# EAGLE design th2 (EAGLE 9.1.3)
CNAME: TempHumid; CREVISION: v2.0; DESIGNER: John Cronin
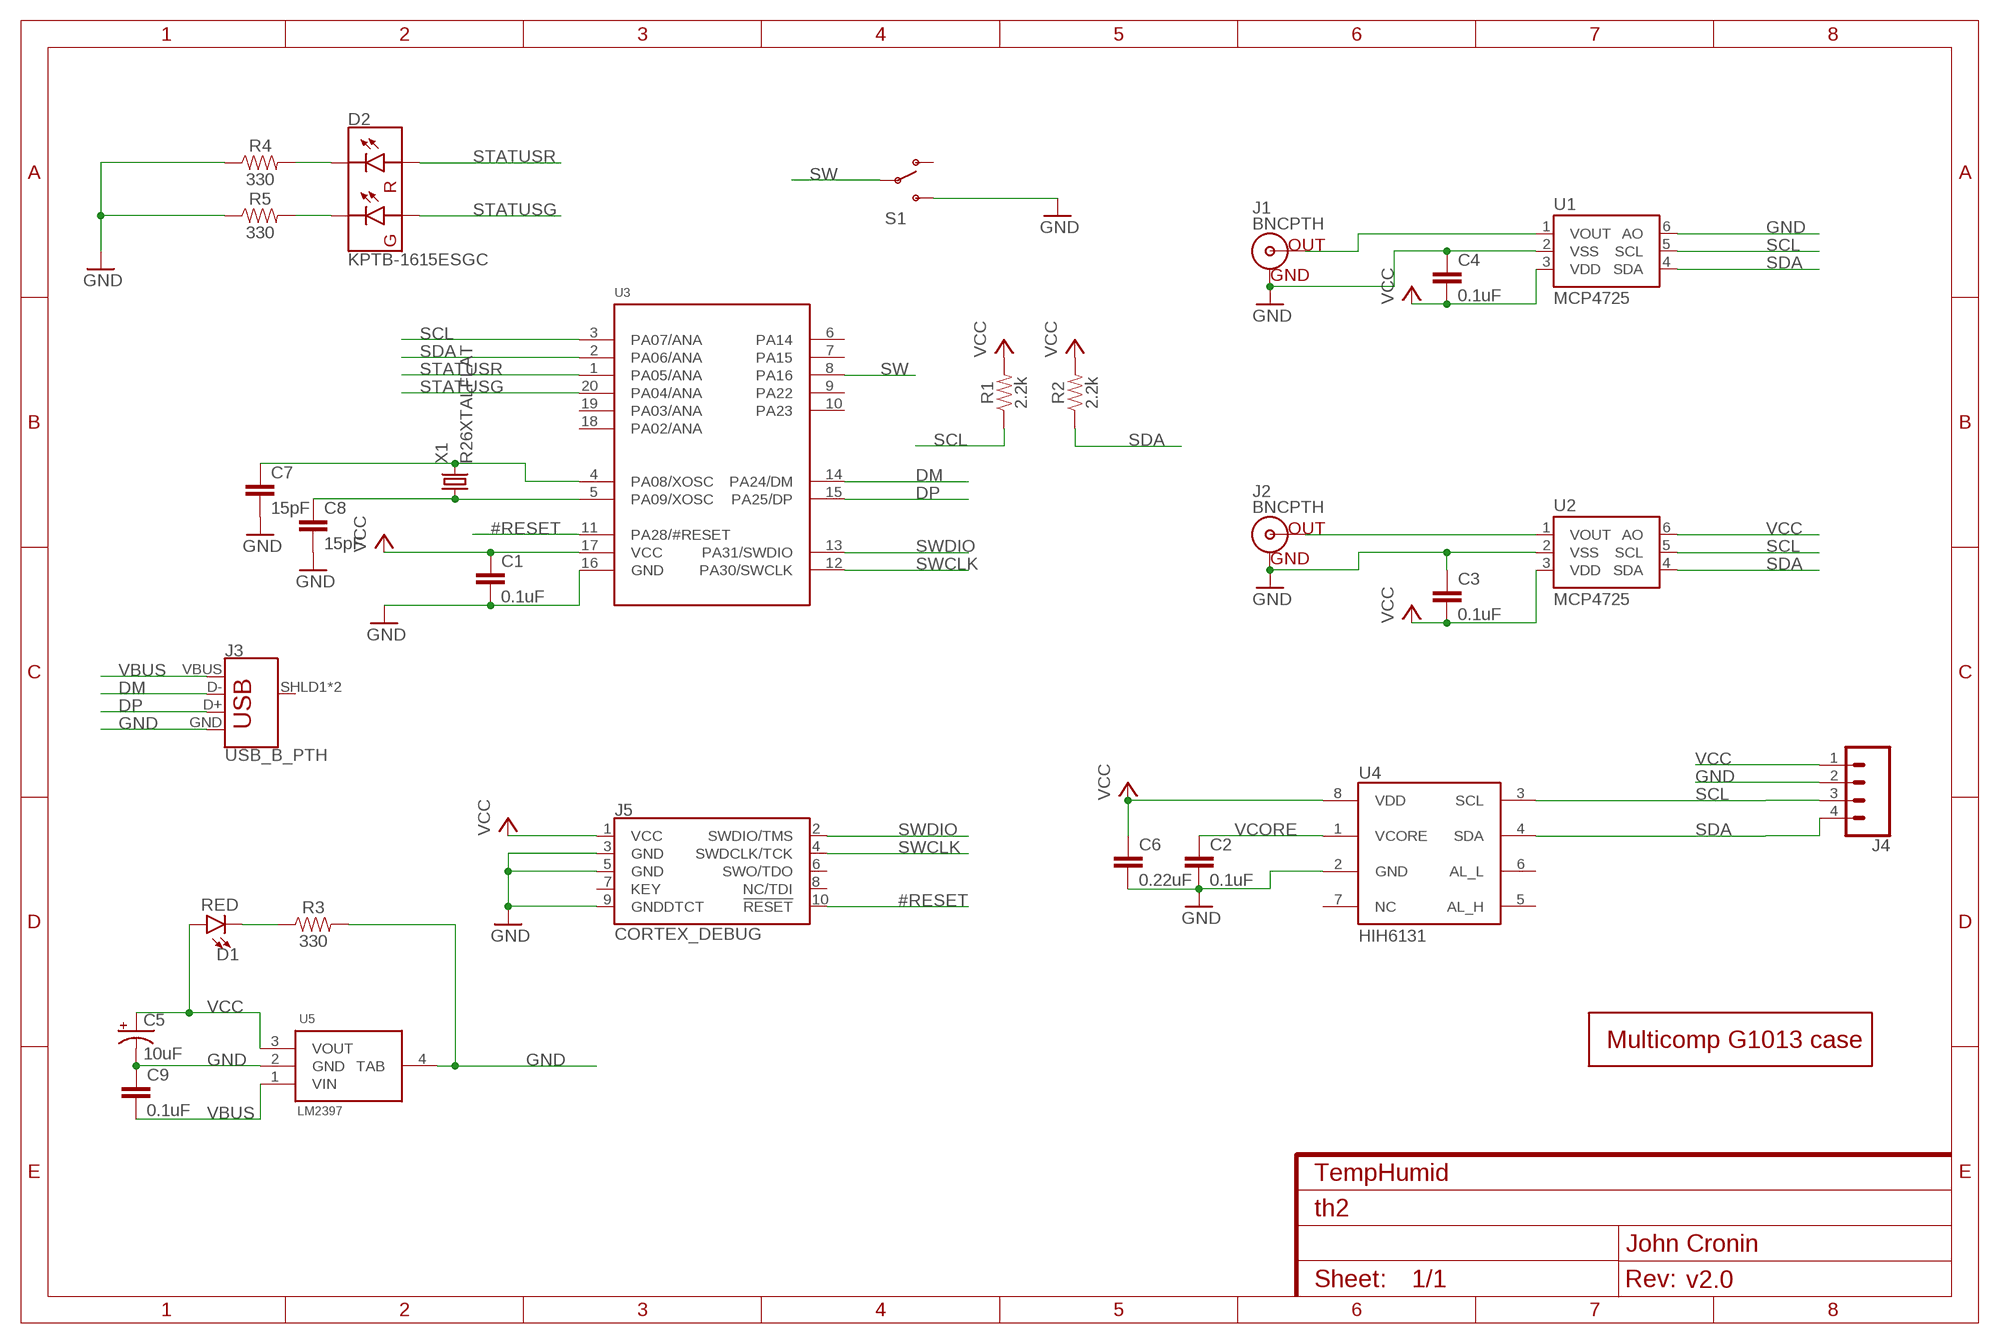
[diagram p0: schematic, sheet 1]

## Parts
C1  0.1uF  0.1UF-0603-25V-(+80/-20%)  [0603]
C2  0.1uF  0.1UF-0603-25V-(+80/-20%)  [0603]
C3  0.1uF  0.1UF-0603-25V-(+80/-20%)  [0603]
C4  0.1uF  0.1UF-0603-25V-(+80/-20%)  [0603]
C5  10uF  10UF-POLAR-RADIAL-2.5MM-25V-20%  [CPOL-RADIAL-2.5MM-5MM]
C6  0.22uF  0.22UF-0603-25V-10%  [0603]
C7  15pF  15PF-0603-50V-5%  [0603]
C8  15pF  15PF-0603-50V-5%  [0603]
C9  0.1uF  0.1UF-0603-25V-(+80/-20%)  [0603]
D1  RED  LED-RED0603  [LED-0603]
D2  KPTB-1615ESGC  LED-RGLTST-C195KGJRKT  [LTST-C195KGJRKT]
J1  BNCPTH  [BNC]
J2  BNCPTH  [BNC]
J3  USB_B_PTH  [USB-B-PTH]
J4  CONN_041.27MM  [1X04_1.27MM]
J5  CORTEX_DEBUG  [SAMTECH_FTSH-105-01]
R1  2.2k  2.2KOHM-0603-1/10W-1%  [0603]
R2  2.2k  2.2KOHM-0603-1/10W-1%  [0603]
R3  330  330OHM-0603-1/10W-1%  [0603]
R4  330  330OHM-0603-1/10W-1%  [0603]
R5  330  330OHM-0603-1/10W-1%  [0603]
S1  SWITCH-SPDTSMD  [SWITCH_SPDT_SMD]
U1  MCP4725  MCP4725SOT-23  [SOT23-6]
U2  MCP4725  MCP4725SOT-23  [SOT23-6]
U3  SAMD11D14A  [SOIC20L]
U4  HIH6131  [SOIC8]
U5  LM2397  [SOT223]
U$1  G1013HOLES  [G1013HOLES]
X1  R26XTALFLAT  [R26FLAT]

## Nets
#RESET: J5.10(!RESET) U3.11(PA28/#RESET)
DM: J3.D- U3.14(PA24/DM)
DP: J3.D+ U3.15(PA25/DP)
GND [power]: C1.2 C2.2 C3.1 C4.1 C5.2(-) C6.2 C7.2 C8.2 C9.1 J1.GND J2.GND J3.GND J4.2 J5.3(GND) J5.5(GND) J5.9(GNDDTCT) R3.2 R4.1 R5.1 S1.3(S) U1.2(VSS) U1.6(AO) U2.2(VSS) U3.16(GND) U4.2(GND) U5.2(GND) U5.4(TAB)
N$1: C7.1 U3.4(PA08/XOSC) X1.P$2
N$2: C8.1 U3.5(PA09/XOSC) X1.P$1
N$3: D1.C R3.1
N$4: D2.P$4(RC) R4.2
N$5: D2.P$3(GC) R5.2
N$6: J1.S(OUT) U1.1(VOUT)
N$9: J2.S(OUT) U2.1(VOUT)
SCL: J4.3 R1.1 U1.5(SCL) U2.5(SCL) U3.3(PA07/ANA) U4.3(SCL)
SDA: J4.4 R2.1 U1.4(SDA) U2.4(SDA) U3.2(PA06/ANA) U4.4(SDA)
STATUSG: D2.P$1(GA) U3.20(PA04/ANA)
STATUSR: D2.P$2(RA) U3.1(PA05/ANA)
SW: S1.2(P) U3.8(PA16)
SWCLK: J5.4(SWDCLK/TCK) U3.12(PA30/SWCLK)
SWDIO: J5.2(SWDIO/TMS) U3.13(PA31/SWDIO)
VBUS [power]: C9.2 J3.VBUS U5.1(VIN)
VCC [power]: C1.1 C3.2 C4.2 C5.1(+) C6.1 D1.A J4.1 J5.1(VCC) R1.2 R2.2 U1.3(VDD) U2.3(VDD) U2.6(AO) U3.17(VCC) U4.8(VDD) U5.3(VOUT)
VCORE: C2.1 U4.1(VCORE)
Unconnected: J3.SHLD1(SHIELD) J3.SHLD2(SHIELD) J5.6(SWO/TDO) J5.7(KEY) J5.8(NC/TDI) S1.1(O) U3.6(PA14) U3.7(PA15) U3.9(PA22) U3.10(PA23) U3.18(PA02/ANA) U3.19(PA03/ANA) U4.5(AL_H) U4.6(AL_L) U4.7(NC)

## Library data of the parts
C1-C4 C9 = SparkFun-Capacitors:0.1UF: 0.1µF ceramic capacitors A capacitor is a passive two-terminal electrical component used to store electrical energy temporarily in an electric field.; PROD_ID: CAP-00810
C5 = SparkFun-Capacitors:10UF-POLAR: 10.0µF polarized capacitors A capacitor is a passive two-terminal electrical component used to store electrical energy temporarily in an electric field.; PROD_ID: CAP-08440
C6 = SparkFun-Capacitors:0.22UF: 0.22µF ceramic capacitors A capacitor is a passive two-terminal electrical component used to store electrical energy temporarily in an electric field.; PROD_ID: CAP-07822
C7 C8 = SparkFun-Capacitors:15PF: 15pF ceramic capacitors A capacitor is a passive two-terminal electrical component used to store electrical energy temporarily in an electric field.; PROD_ID: CAP-07881
D1 = SparkFun-LED:LED-RED: Red SMD LED Used in manufacturing of most products at SparkFun Packages: 0603 - SMD 0603 package [Product Link] <http://docs.avagotech.com/docs/AV02-0551EN> 0603 SMART - SMD 0603 SMART package ( more efficient and expensive)[Product Link] <http://www.osram-os.com/Graphics/XPic2/00077099_0.pdf> 1206 - SMD1206 package [Product Link] <https://www.sparkfun.com/datasheets/DevTools/LilyPad/Q150OVS4.pdff> SparkFun Products: Pro Mini 328 -5V <https://www.sparkfun.com/products/821> RedBoard <https://www.sparkfun.com/products/12757> IOIO-OTG <https://www.sparkfun.com/products/13613>; PROD_ID: DIO-00819
D2 = SparkFun-LED:LED-RG: LiteOn Technology Corporation LTST-C195KGJRKT - LED GREEN/RED CLEAR 0606 SMD Color: Red/Green Lens Transparency: Clear Lens Style/Size: Rectangle with Flat top, 1.10 x 1.5 mm mC Rating45mcd Red, 35 mcd Green Current: 20mA Red, 20mA Green Forward Voltage: 2V Red, 2V Green Packages: 0606 SparkFun Products: Electric Imp imp002 Breakout <[https://www.sparkfun.com/products/12958]>; PROD_ID: DIO-12140
J1 J2 = SparkFun-Connectors:BNC: BNC Right Angle Connector Mouser Part# 5227161 SparkFun Products: BNC Connector - Right Angle <https://www.sparkfun.com/products/10550>; PROD_ID: LPA-12729; SF_ID: PRT-10550
J3 = SparkFun-Connectors:USB_B: USB Type B Connector SparkFun Products: SparkFun Stepoko <https://www.sparkfun.com/products/13899> PTH; PROD_ID: CONN-08278; SF_ID: PRT-00139
J4 = SparkFun-Connectors:CONN_04: Multi connection point. Often used as Generic Header-pin footprint for 0.1 inch spaced/style header connections On any of the 0.1 inch spaced packages, you can populate with these: Break Away Headers - Straight <https://www.sparkfun.com/products/116> (PRT-00116) Break Away Male Headers - Right Angle <https://www.sparkfun.com/products/553> (PRT-00553) Female Headers <https://www.sparkfun.com/products/115> (PRT-00115) Break Away Headers - Machine Pin <https://www.sparkfun.com/products/117> (PRT-00117) Break Away Female Headers - Swiss Machine Pin <https://www.sparkfun.com/products/743> (PRT-00743) For SCREWTERMINALS and SPRING TERMINALS visit here: Screw Terimnals on SparkFun.com <https://www.sparkfun.com/search/results?term=Screw+Terminals> (5mm/3.5mm/2.54mm spacing) This device is also useful as a general connection point to wire up your design to another part of your project. Our various solder wires solder well into these plated through hole pads. Hook-Up Wire - Assortment (Stranded, 22 AWG) <https://www.sparkfun.com/products/11375> (PRT-11375) Hook-Up Wire - Assortment (Solid Core, 22 AWG) <https://www.sparkfun.com/products/11367> (PRT-11367) View the entire wire category on our website here <https://www.sparkfun.com/categories/141> Special notes: Molex polarized connector foot print use with SKU : PRT-08231 with associated crimp pins and housings. 1MM SMD Version SKU: PRT-10208
J5 = atmel-samd:CORTEX_DEBUG
R1 R2 = SparkFun-Resistors:2.2KOHM: 2.2kΩ resistor A resistor is a passive two-terminal electrical component that implements electrical resistance as a circuit element. Resistors act to reduce current flow, and, at the same time, act to lower voltage levels within circuits. - Wikipedia; PROD_ID: RES-08272
R3-R5 = SparkFun-Resistors:330OHM: 330Ω resistor A resistor is a passive two-terminal electrical component that implements electrical resistance as a circuit element. Resistors act to reduce current flow, and, at the same time, act to lower voltage levels within circuits. - Wikipedia; PROD_ID: RES-00818
S1 = SparkFun-Retired:SWITCH-SPDT: SPDT Switch Simple slide switch, Spark Fun Electronics SKU : COM-00102 DPDT SMT slide switch, AYZ0202, SWCH-08179
U1 U2 = SparkFun-IC-Conversion:MCP4725: MCP4725 DAC Microchip 12-bit I2C DAC, SOT23-6 Datasheet <https://cdn.sparkfun.com/datasheets/BreakoutBoards/MCP4725_2009.pdf> SparkFun Products SparkFun I2C DAC Breakout - MCP4725 <https://www.sparkfun.com/products/12918> (BOB-12918); PROD_ID: IC-08886
U3 = atmel-samd:SAMD11D14A
U4 = SparkFun-Retired:HIH6131: Humidity sensor Not in catalog
U5 = atmel-samd:LM2397
U$1 = atmel-samd:G1013: Multicomp G1013 case
X1 = atmel-samd:R26XTAL: Raltron Radial Oscillator

## Net classes
1 power: width 0.305 mm

## Board
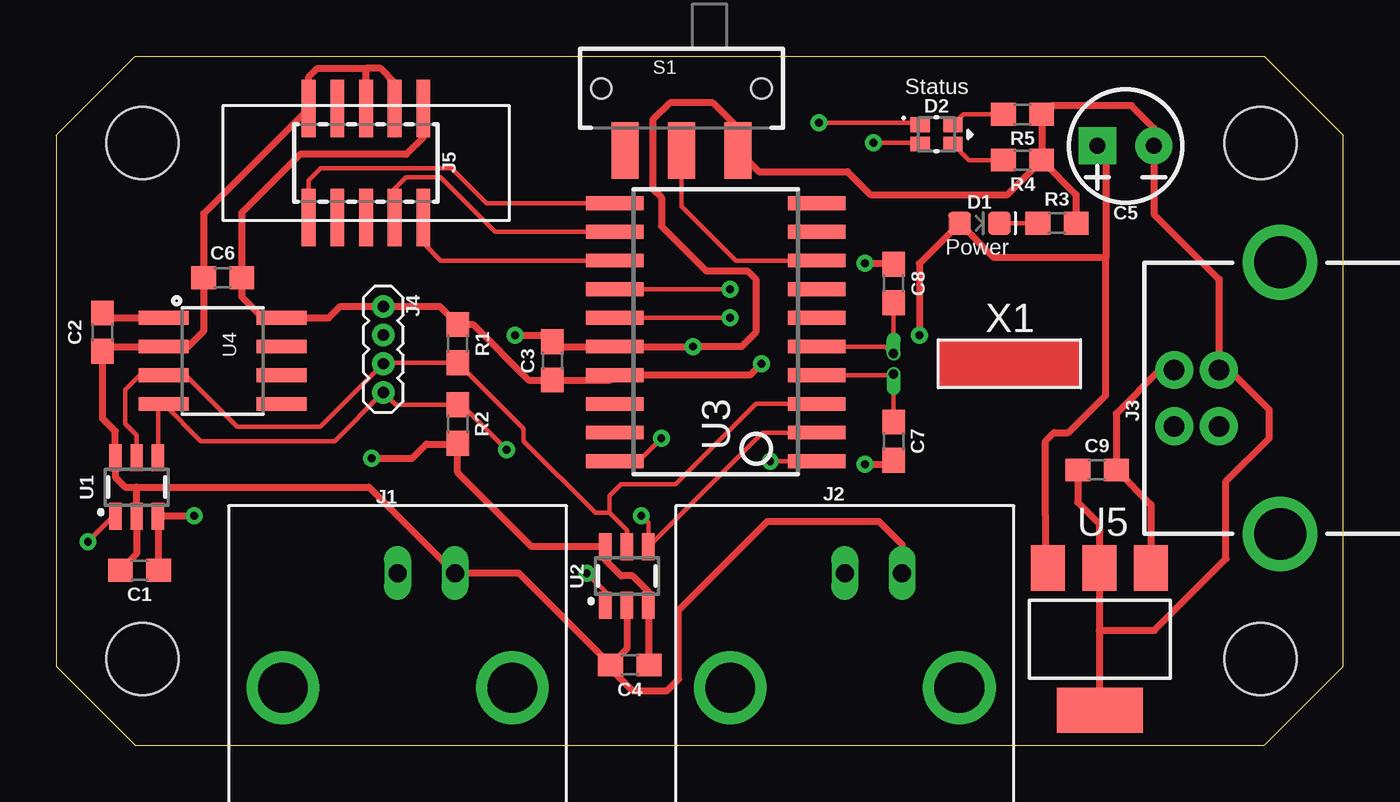
[diagram p1: board, top side]
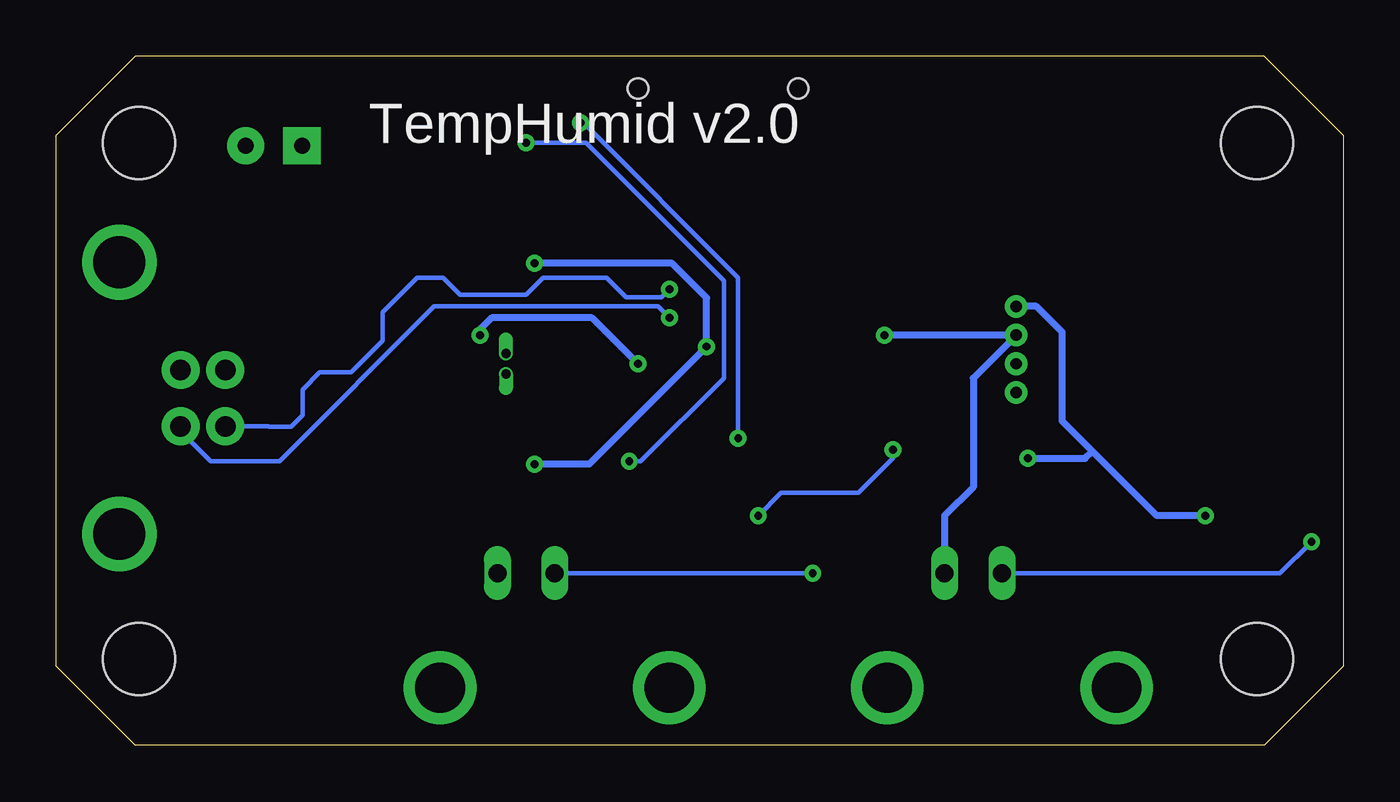
[diagram p2: board, bottom side, seen from below]

Size 57 x 30.5 mm. Coordinates in mm from the lower left corner, seen from the top.
Copper layers (1*16): Top 0.035mm / dielectric 1.5mm / Bottom 0.035mm
Design rules "jlcpcb-2oz": minimum track width 8mil, minimum drill 0.3mm, track to track 8mil, track to pad 8mil, pad to pad 8mil, via to via 8mil, smd to smd 5mil, copper to edge 0.2mm, drill to drill 6mil, minimum pad ring 3mil, minimum via ring 0.2mm, stop-mask expansion 4mil, vias tented up to drill 14mil, thermal gap 10mil

### Footprints (pad centres in the part's own frame; a part is rotated, then mirrored left to right if it is on the bottom)
0603 = smd 1.1 x 1: 1 -0.85,0; 2 0.85,0
CPOL-RADIAL-2.5MM-5MM = drill 0.7 pad 1.651 square: 1 1.25,0 | drill 0.7 pad 1.651: 2 -1.25,0
LED-0603 = smd 1 x 1: A -0.877,0; C 0.877,0
LTST-C195KGJRKT = smd 0.85 x 0.65: P$1 -0.725,0.425; P$2 -0.725,-0.425; P$3 0.725,0.425; P$4 0.725,-0.425
BNC = drill 2.2: 3 -5.08,5.08; 4 5.08,5.08 | drill 0.8 long: GND -2.54,0; S 0,0
USB-B-PTH = drill 0.914 pad 1.676: D+ 4,1.25; D- 5.981,1.25; GND 4,-1.25; VBUS 5.981,-1.25 | drill 2.286: SHLD1 1.282,-6.02; SHLD2 1.282,6.02
1X04_1.27MM = drill 0.508 pad 1: 1 0,0; 2 1.27,0; 3 2.54,0; 4 3.81,0
SAMTECH_FTSH-105-01 = smd 0.61 x 2.54: 1 -2.54,-2.413; 2 -2.54,2.413; 3 -1.27,-2.413; 4 -1.27,2.413; 5 0,-2.413; 6 0,2.413; 7 1.27,-2.413; 8 1.27,2.413; 9 2.54,-2.413; 10 2.54,2.413
SWITCH_SPDT_SMD = smd 1.2 x 2.5: 1 -2.5,-2.75; 2 0,-2.75; 3 2.5,-2.75 | hole 0.9: -3.55,0; 3.55,0
SOT23-6 = smd 0.55 x 1.2: 1 0.95,1.3; 2 0,1.3; 3 -0.95,1.3; 4 -0.95,-1.3; 5 0,-1.3; 6 0.95,-1.3
SOIC20L = smd 0.61 x 2.54: 1 -5.715,-4.475; 2 -4.445,-4.475; 3 -3.175,-4.475; 4 -1.905,-4.475; 5 -0.635,-4.475; 6 0.635,-4.475; 7 1.905,-4.475; 8 3.175,-4.475; 9 4.445,-4.475; 10 5.715,-4.475; 11 5.715,4.475; 12 4.445,4.475; 13 3.175,4.475; 14 1.905,4.475; 15 0.635,4.475; 16 -0.635,4.475; 17 -1.905,4.475; 18 -3.175,4.475; 19 -4.445,4.475; 20 -5.715,4.475
SOIC8 = smd 0.61 x 2.21: 1 -1.905,-2.616; 2 -0.635,-2.616; 3 0.635,-2.616; 4 1.905,-2.616; 5 1.905,2.616; 6 0.635,2.616; 7 -0.635,2.616; 8 -1.905,2.616
SOT223 = smd 1.499 x 2.007: 1 -2.261,-3.15; 2 0.025,-3.15; 3 2.311,-3.15 | smd 3.81 x 2.007: 4 0,3.15
G1013HOLES = hole 3.2: 3.81,26.67; 3.81,3.81; 53.34,3.81; 53.34,26.67
R26FLAT = drill 0.406 pad 0.597 offset: P$1 -0.457,0; P$2 0.457,0

### Placement (x,y rotation side)
C1  3.68,7.75 180 top
C2  2.03,18.29 270 top
C3  21.97,17.02 270 top
C4  25.4,3.56 0 top
C5  47.37,26.54 180 top
C6  7.37,20.7 180 top
C7  37.08,13.46 270 top
C8  37.08,20.45 90 top
C9  46.1,12.19 0 top
D1  40.89,23.11 0 top
D2  38.99,27.05 0 top
J1  15.11,7.62 180 top
J2  34.92,7.62 180 top
J3  55.5,15.37 180 top
J4  14.48,19.43 270 top
J5  13.72,25.78 180 top
R1  17.78,17.78 90 top
R2  17.78,14.22 270 top
R3  44.32,23.11 0 top
R4  42.8,25.91 180 top
R5  42.8,27.94 180 top
S1  27.69,29.08 0 top
U1  3.56,11.43 180 top
U2  25.27,7.49 180 top
U3  29.21,18.29 90 top
U4  7.37,17.02 270 top
U5  46.23,4.7 180 top
U$1  0,0 0 top
X1  37.08,16.89 270 top

### Tracks (layer width: path | path; a pad name or v marks a point on that pad's centre or on a via)
#RESET
  Top 0.203: U3.11 19.05,24 17.5,25.55 11.71,25.55 11.18,25.02 J5.10
DM  (via drill 0.35)
  Top 0.203: U3.14 v29.84,20.19
  Bottom 0.203: J3.D- 47.6,14.12 47.59,14.1 46.61,14.1 46.1,14.61 46.1,15.75 45.34,16.51 43.94,16.51 42.55,17.91 42.55,19.18 41.02,20.7 39.88,20.7 39.12,19.94 36.2,19.94 35.43,20.7 32.64,20.7 31.77,19.84 30.2,19.84 v29.84,20.19
DP  (via drill 0.35)
  Top 0.203: U3.15 v29.84,18.92
  Bottom 0.203: J3.D+ 51.5,13.91 50.16,12.57 47.12,12.57 40.26,19.43 30.35,19.43 v29.84,18.92
GND  (via drill 0.35)
  Top 0.305: U2.2 25.27,4.28 C4.1 | C1.2 3.56,8.47 U1.2 3.56,11.43 | 13.72,29.97 11.56,29.97 11.18,29.59 J5.9 6.52,23.53 C6.2 6.52,18.33 5.84,17.65 U4.2 2.25,17.65 C2.2 2.03,14.48 2.61,13.9 U1.6 2.61,11.87 3.05,11.43 3.56,11.43 | J5.3 14.99,29.34 14.35,29.97 13.72,29.97 | C4.1 24.55,3.39 25.53,2.41 27.05,2.41 27.56,2.92 27.56,5.97 31.5,9.91 36.45,9.91 37.47,8.89 J2.GND | C4.1 20.49,7.62 J1.GND 13.84,11.43 3.56,11.43 | R5.1 43.65,27.81 | 43.65,27.81 R4.1 | R4.1 45.17,24.38 R3.2 | R4.1 42.12,24.38 36.07,24.38 35.05,25.4 31.12,25.4 S1.3 30.19,27.34 29.08,28.45 27.18,28.45 26.42,27.69 26.42,24.64 26.8,24.26 26.8,22.99 28.78,21.01 30.61,21.01 30.99,20.62 30.99,18.29 30.35,17.65 v28.19,17.65 U3.16 22.19,17.65 C3.1 21.68,18.16 v20.32,18.16 | v35.81,21.34 37.05,21.34 C8.2 | v35.81,12.45 36.92,12.45 C7.2 | C9.1 45.25,10.76 46.2,9.8 U5.2 46.2,5.08 | 46.2,5.08 46.2,1.57 U5.4 | 46.2,5.08 48.64,5.08 51.82,8.26 51.82,11.68 53.72,13.59 53.72,14.86 51.96,16.62 J3.GND 51.5,20.64 48.62,23.52 C5.2 48.62,27.32 47.62,28.32 44.16,28.32 43.65,27.81 | J5.5 13.72,29.97
  Bottom 0.305: J1.GND 17.65,10.16 16.38,11.43 16.38,16.26 J4.2 v20.32,18.16 | v35.81,21.34 29.72,21.34 28.19,19.81 v28.19,17.65 33.4,12.45 v35.81,12.45
N$1
  Top 0.203: U3.4 36.93,16.38 X1.P$2 C7.1
N$2
  Top 0.203: U3.5 36.68,17.65 X1.P$1 C8.1
N$3
  Top 0.203: D1.C R3.1
N$4
  Top 0.203: D2.P$4 40.43,25.91 R4.2
N$5
  Top 0.203: D2.P$3 40.18,27.94 R5.2
N$6  (via drill 0.35)
  Top 0.203: v1.4,9.02 2.51,10.13 U1.1
  Bottom 0.203: J1.S 2.79,7.62 v1.4,9.02
N$9  (via drill 0.35)
  Top 0.203: v23.5,7.62 24.32,6.79 U2.1
  Bottom 0.203: J2.S v23.5,7.62
SCL
  Top 0.203: U1.5 3.56,13.72 3.05,14.22 3.05,15.75 3.68,16.38 U4.3 5.71,16.38 8,14.1 11.68,14.1 J4.3 14.52,16.93 R1.1 20.7,14.01 20.7,13.46 23.88,10.29 24.13,10.29 24.51,10.29 | U3.3 30.99,15.11 27.43,11.56 25.02,11.56 24.51,11.05 24.51,10.29 | U2.5 25.27,9.53 24.51,10.29
SDA  (via drill 0.35)
  Top 0.203: U1.4 4.51,14.87 U4.4 6.4,13.46 12.32,13.46 J4.4 15.03,15.07 R2.1 17.95,15.07 v19.94,13.08 | U3.2 31.27,13.84 U2.4 26.22,9.85 v25.91,10.16
  Bottom 0.203: v25.91,10.16 24.89,11.18 21.46,11.18 19.94,12.7 v19.94,13.08
STATUSG  (via drill 0.35)
  Top 0.203: U3.20 25.78,12.57 v26.8,13.59 | v33.78,27.56 38.18,27.56 D2.P$1
  Bottom 0.203: v26.8,13.59 26.8,20.7 33.66,27.56 v33.78,27.56
STATUSR  (via drill 0.35)
  Top 0.203: U3.1 v31.62,12.57 | v36.2,26.67 38.22,26.67 D2.P$2
  Bottom 0.203: v31.62,12.57 31.11,12.57 27.43,16.26 27.43,20.57 33.53,26.67 v36.2,26.67
SW
  Top 0.203: U3.8 30.1,21.46 27.69,23.88 S1.2
SWCLK
  Top 0.203: U3.12 19.43,22.73 17.02,25.15 15.49,25.15 14.99,24.64 J5.4
SWDIO
  Top 0.203: U3.13 17.02,21.46 16.26,22.23 J5.2
VBUS
  Top 0.305: U5.1 48.49,10.65 C9.2 46.95,14.69 48.88,16.62 J3.VBUS
VCC  (via drill 0.35)
  Top 0.305: C4.2 26.22,3.58 U2.3 26.22,6.8 25.53,7.49 25.02,7.49 24.32,8.19 U2.6 21.05,8.79 17.78,12.06 R2.2 17.74,13.34 16.38,13.34 15.75,12.7 v13.97,12.7 | C1.1 4.51,7.77 U1.3 4.54,10.16 v6.1,10.16 | J5.1 16.26,26.92 15.49,26.16 10.79,26.16 8.22,23.58 C6.1 8.22,19.85 9.14,18.92 U4.8 12.06,18.92 12.57,19.43 J4.1 16.98,19.43 R1.2 18.45,18.63 20.92,16.17 C3.2 24.52,16.17 U3.17 30.73,16.38 v31.24,16.89 | 46.48,21.59 45.72,21.59 | 45.72,21.59 41.54,21.59 D1.A 38.23,21.32 v38.23,18.16 | 45.72,21.59 | 46.48,21.59 46.48,15.49 44.83,13.84 44.2,13.84 43.81,13.46 43.81,10.16 43.81,7.95 U5.3 | C5.1 46.48,26.18 46.48,21.59
  Bottom 0.305: v6.1,10.16 8.26,10.16 11.11,13.02 | J4.1 13.59,19.43 12.45,18.29 12.45,14.35 11.11,13.02 | v13.97,12.7 11.43,12.7 11.11,13.02 | v38.23,18.16 38.23,18.41 37.72,18.92 33.27,18.92 v31.24,16.89
VCORE
  Top 0.305: C2.1 2.25,18.92 U4.1

### Text on the board
tPlace: Status | Power
bPlace: TempHumid v2.0